# Altium project SOUL_EEG.PrjPcb
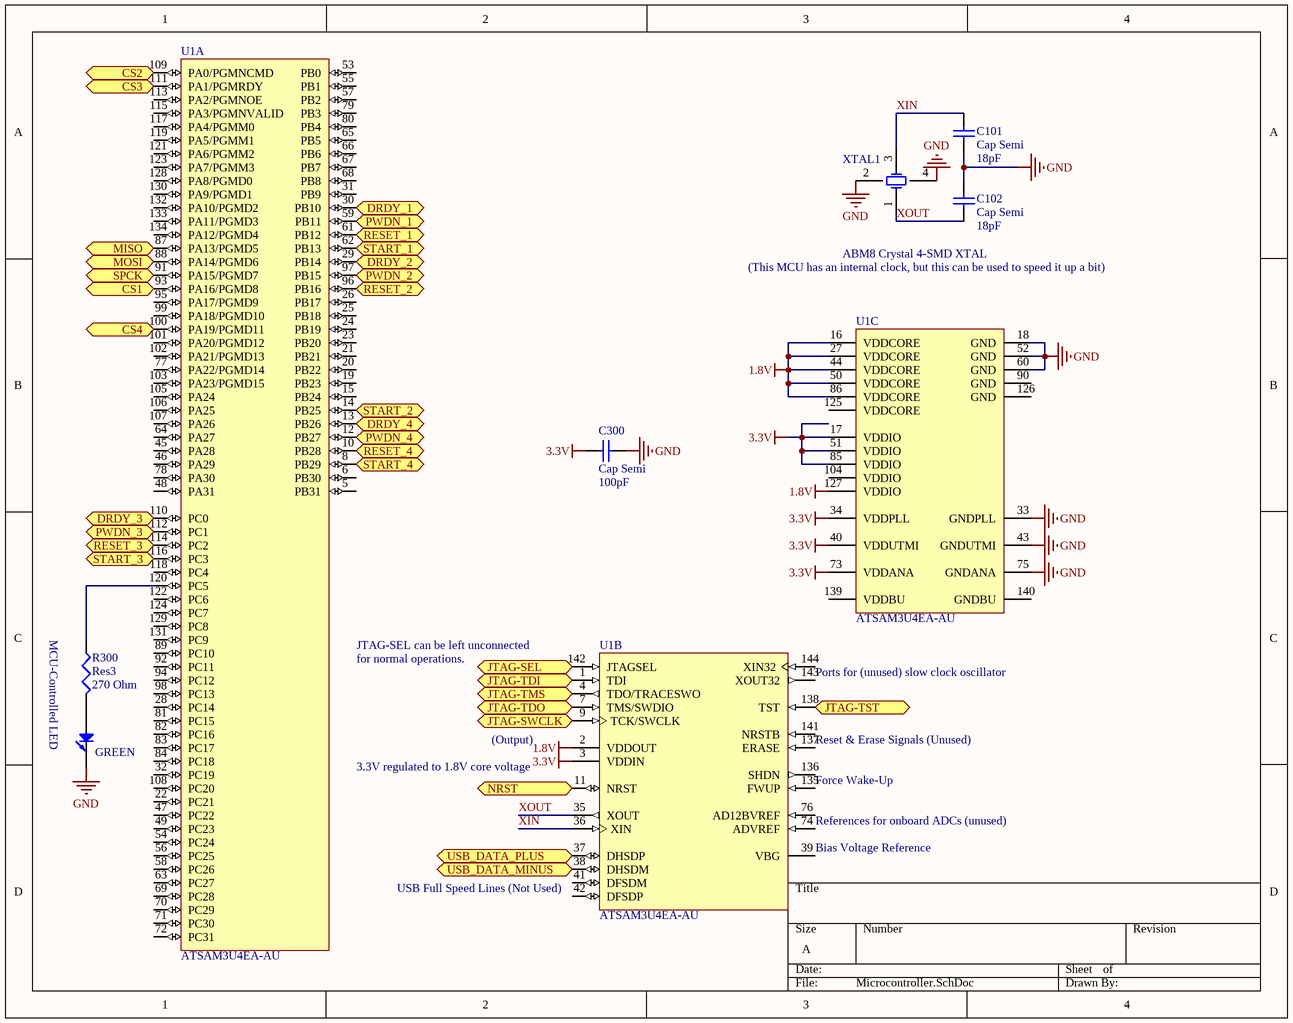
[diagram p0: Microcontroller.SchDoc]
7 sheets, 183 parts. Net scope: flat (ports and power ports of the same name join across sheets).
Board file: SOUL_EEG_PCB_Rev1.PcbDoc
Sheets:
  Microcontroller.SchDoc
  JTAG_Connector.SchDoc
  USB_Controller.SchDoc
  EEG_1.SchDoc
  EEG_2.SchDoc
  EEG_3.SchDoc
  EEG_4.SchDoc

## Sheet Microcontroller.SchDoc
size A

### Parts
C101  Cap Semi  value 18pF  [1608[0603]]
C102  Cap Semi  value 18pF  [1608[0603]]
C300  Cap Semi  value 100pF  [C1206]
LED2  GREEN  [1608[0603]]
R300  Res3  value 270 Ohm  [1608[0603]]
U1  ATSAM3U4EA-AU  [144L1_N]  (parts A,B,C of 3)
XTAL1  ABM8 Crystal 4-SMD XTAL  [ABM8 Crystal XTAL]

### Ports
CS1, CS2, CS3, CS4, DRDY_1, DRDY_2, DRDY_3, DRDY_4, JTAG-SEL, JTAG-SWCLK, JTAG-TDI, JTAG-TDO, JTAG-TMS, JTAG-TST, MISO, MOSI, NRST, PWDN_1, PWDN_2, PWDN_3, PWDN_4, RESET_1, RESET_2, RESET_3, RESET_4, SPCK, START_1, START_2, START_3, START_4, USB_DATA_MINUS, USB_DATA_PLUS

### Nets
1.8V: U1.2(VDDOUT) U1.16(VDDCORE) U1.27(VDDCORE) U1.44(VDDCORE) U1.50(VDDCORE) U1.86(VDDCORE) U1.127(VDDIO)
3.3V: C300.1 U1.3(VDDIN) U1.17(VDDIO) U1.34(VDDPLL) U1.40(VDDUTMI) U1.51(VDDIO) U1.73(VDDANA) U1.85(VDDIO)
GND: C101.1 C102.2 C300.2 LED2.2(K) U1.18(GND) U1.33(GNDPLL) U1.43(GNDUTMI) U1.52(GND) U1.60(GND) U1.75(GNDANA) XTAL1.2(GND) XTAL1.4(GND)
XIN: C101.2 U1.36(XIN) XTAL1.3(OSC2)
XOUT: C102.1 U1.35(XOUT) XTAL1.1(OSC1)
NetLED2_1: LED2.1(A) R300.2
NetP100_5: U1.1(TDI) ; port JTAG-TDI
NetP100_7: U1.4(TDO/TRACESWO) ; port JTAG-TMS
NetP100_9: U1.9(TCK/SWCLK) ; port JTAG-SWCLK
NetP100_13: U1.7(TMS/SWDIO) ; port JTAG-TDO
NetP100_15: U1.11(NRST) ; port NRST
NetP101_1: U1.138(TST) ; port JTAG-TST
NetP102_2: U1.38(DHSDM) ; port USB_DATA_MINUS
NetP102_3: U1.37(DHSDP) ; port USB_DATA_PLUS
NetR300_1: R300.1 U1.120(PC5)
NetU1_8: U1.8(PB29) ; port START_4
NetU1_10: U1.10(PB28) ; port RESET_4
NetU1_12: U1.12(PB27) ; port PWDN_4
NetU1_13: U1.13(PB26) ; port DRDY_4
NetU1_14: U1.14(PB25) ; port START_2
NetU1_29: U1.29(PB14) ; port DRDY_2
NetU1_30: U1.30(PB10) ; port DRDY_1
NetU1_59: U1.59(PB11) ; port PWDN_1
NetU1_61: U1.61(PB12) ; port RESET_1
NetU1_62: U1.62(PB13) ; port START_1
NetU1_87: U1.87(PA13/PGMD5) ; port MISO
NetU1_88: U1.88(PA14/PGMD6) ; port MOSI
NetU1_91: U1.91(PA15/PGMD7) ; port SPCK
NetU1_93: U1.93(PA16/PGMD8) ; port CS1
NetU1_96: U1.96(PB16) ; port RESET_2
NetU1_97: U1.97(PB15) ; port PWDN_2
NetU1_100: U1.100(PA19/PGMD11) ; port CS4
NetU1_109: U1.109(PA0/PGMNCMD) ; port CS2
NetU1_110: U1.110(PC0) ; port DRDY_3
NetU1_111: U1.111(PA1/PGMRDY) ; port CS3
NetU1_112: U1.112(PC1) ; port PWDN_3
NetU1_114: U1.114(PC2) ; port RESET_3
NetU1_116: U1.116(PC3) ; port START_3
NetU1_142: U1.142(JTAGSEL) ; port JTAG-SEL

Not connected (* = marked no-connect by the designer): U1 5(PB31) 6(PB30) 15(PB24) 19(PB23) 20(PB22) 21(PB21) 22(PC21) 23(PB20) 24(PB19) 25(PB18) 26(PB17) 28(PC14) 31(PB9) 32(PC19) 39(VBG) 41(DFSDM) 42(DFSDP) 45(PA28) 46(PA29) 47(PC22) 48(PA31) 49(PC23) 53(PB0) 54(PC24) 55(PB1) 56(PC25) 57(PB2) 58(PC26) 63(PC27) 64(PA27) 65(PB5) 66(PB6) 67(PB7) 68(PB8) 69(PC28) 70(PC29) 71(PC30) 72(PC31) 74(ADVREF) 76(AD12BVREF) 77(PA22/PGMD14) 78(PA30) 79(PB3) 80(PB4) 81(PC15) 82(PC16) 83(PC17) 84(PC18) 89(PC10) 90(GND) 92(PC11) 94(PC12) 95(PA17/PGMD9) 98(PC13) 99(PA18/PGMD10) 101(PA20/PGMD12) 102(PA21/PGMD13) 103(PA23/PGMD15) 104(VDDIO) 105(PA24) 106(PA25) 107(PA26) 108(PC20) 113(PA2/PGMNOE) 115(PA3/PGMNVALID) 117(PA4/PGMM0) 118(PC4) 119(PA5/PGMM1) 121(PA6/PGMM2) 122(PC6) 123(PA7/PGMM3) 124(PC7) 125(VDDCORE) 126(GND) 128(PA8/PGMD0) 129(PC8) 130(PA9/PGMD1) 131(PC9) 132(PA10/PGMD2) 133(PA11/PGMD3) 134(PA12/PGMD4) 135(FWUP) 136(SHDN) 137(ERASE) 139(VDDBU) 140(GNDBU) 141(NRSTB) 143(XOUT32) 144(XIN32)

### Notes on the sheet
- (This MCU has an internal clock, but this can be used to speed it up a bit)
- MCU-Controlled LED
- (near U1) JTAG-SEL can be left unconnected
- (near U1) for normal operations.
- (near U1) Ports for (unused) slow clock oscillator
- (near U1) 3.3V regulated to 1.8V core voltage
- (Output)
- (near U1) Reset & Erase Signals (Unused)
- (near U1) Force Wake-Up
- (near U1) References for onboard ADCs (unused)
- (near U1) USB Full Speed Lines (Not Used)
- (near U1) Bias Voltage Reference

### Library data of the parts
C101 C102 C300 = Cap Semi: Capacitor (Semiconductor SIM Model); Published: 8-Jun-2000; LatestRevisionDate: 29-May-2009; LatestRevisionNote: IPC-7351 Footprint Added.; PackageReference: C1206; Publisher: Altium Limited; PackageDescription: Chip Capacitor
LED2 = LED0: led; Manufacturer: Lite-On Inc; Manufacturer Part Number: LTST-C193KGKT-5A; Wavelength - Dominant: 572nm; Wavelength - Peak: 574nm; Millicandela Rating: 16.25mcd; Voltage - Forward (Vf) (Typ): 2V; Current - Test: 5mA; Viewing Angle: 130°; Lens Type: Clear; Lens Style/Size: Rectangle with Flat Top, 1.15mm x 0.8mm; Supplier 1: Digi-Key; Supplier Part Number 1: 160-1828-1-ND; RoHS: RoHS Compliant; Category: Optoelectronics; Stock 1: 69140; Pricing 1: 1=0.43, 10=0.315, 100=0.167, 250=0.11812, 500=0.1008, 1000=0.07875 (USD); Packaging: Cut Tape (CT); Color: Green; Package / Case: 0603 (1608 Metric); Size / Dimension: 1.60mm L x 0.80mm W; Height: 0.35mm; Mounting Type: Surface Mount; Luminous Flux @ Current - Test: -; ComponentLink1URL: http://optoelectronics.liteon.com/upload/download/DS22-2007-0094/S_110_LTST-C193KGKT-5A.pdf; ComponentLink1Description: http://optoelectronics.liteon.com/upload/download/DS22-2007-0094/S_110_LTST-C193KGKT-5A.pdf
R300 = Res3: Resistor; Published: 8-Jun-2000; LatestRevisionDate: 29-May-2009; LatestRevisionNote: IPC-7351 Footprint Added.; PackageReference: J1-0603; Publisher: Altium Limited; PackageDescription: Chip Resistor
U1 = ATSAM3U4EA-AU: AT91 ARM Cortex-M3 32-bit Microcontroller, 2x128KB Flash, 52KB SRAM, 96 User I/Os, 4USARTs, 144-Pin LQFP, Industrial Grade (-40°C to 85°C), Pb-Free; Published: 20-Sep-2010; DatasheetVersion: revC, Apr-2010; PackageVersion: rev.A, Nov-2001; PackageReference: 144L1; Publisher: Altium Limited; PackageDescription: 144-Pin Thin Quad Flat Pack 0.5 mm Pitch; Supplier 1: Digi-Key; Supplier Part Number 1: ATSAM3U4EA-AU-ND; Supplier 2: Mouser; Supplier Part Number 2: 556-ATSAM3U4EA-AU; Code_JEDEC: MS-026-BFB; ComponentLink1Description: Manufacturer Link; ComponentLink1URL: http://www.atmel.com/products/AT91/default.asp?; ComponentLink2Description: SAM3U Series Datasheet; ComponentLink2URL: http://www.atmel.com/dyn/resources/prod_documents/doc6430.pdf; ComponentLink3Description: SAM3U Series Summary; ComponentLink3URL: http://www.atmel.com/dyn/resources/prod_documents/6430s.pdf; ComponentLink4Description: Atmel.com Home; ComponentLink4URL: http://www.atmel.com
XTAL1 = ABM8 Crystal 4-SMD XTAL_1: SMD Crystal

## Sheet JTAG_Connector.SchDoc
size A
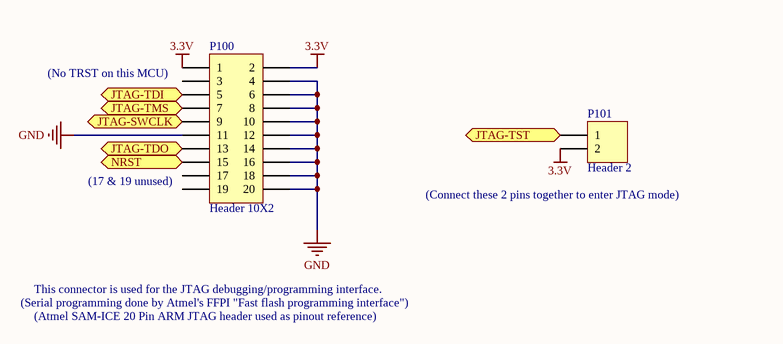
[diagram p1: JTAG_Connector.SchDoc]

### Parts
P100  Header 10X2  [HDR2X10]
P101  Header 2  [HDR1X2]

### Ports
JTAG-SWCLK, JTAG-TDI, JTAG-TDO, JTAG-TMS, JTAG-TST, NRST

### Nets
3.3V: P100.1 P100.2 P101.2
GND: P100.4 P100.6 P100.8 P100.10 P100.11 P100.12 P100.14 P100.16 P100.18 P100.20
NetP100_5: P100.5 ; port JTAG-TDI
NetP100_7: P100.7 ; port JTAG-TMS
NetP100_9: P100.9 ; port JTAG-SWCLK
NetP100_13: P100.13 ; port JTAG-TDO
NetP100_15: P100.15 ; port NRST
NetP101_1: P101.1 ; port JTAG-TST

Not connected (* = marked no-connect by the designer): P100 3 17 19

### Notes on the sheet
- (near P100) (No TRST on this MCU)
- (near P100) (17 & 19 unused)
- (near P101) (Connect these 2 pins together to enter JTAG mode)
- (Serial programming done by Atmel's FFPI "Fast flash programming interface")
- This connector is used for the JTAG debugging/programming interface.
- (Atmel SAM-ICE 20 Pin ARM JTAG header used as pinout reference)

### Library data of the parts
P100 = Header 10X2: Header, 10-Pin, Dual row; LatestRevisionDate: 17-Jul-2002; LatestRevisionNote: Re-released for DXP Platform.; Publisher: Altium Limited
P101 = Header 2: Header, 2-Pin; LatestRevisionDate: 17-Jul-2002; LatestRevisionNote: Re-released for DXP Platform.; Publisher: Altium Limited

## Sheet USB_Controller.SchDoc
size A
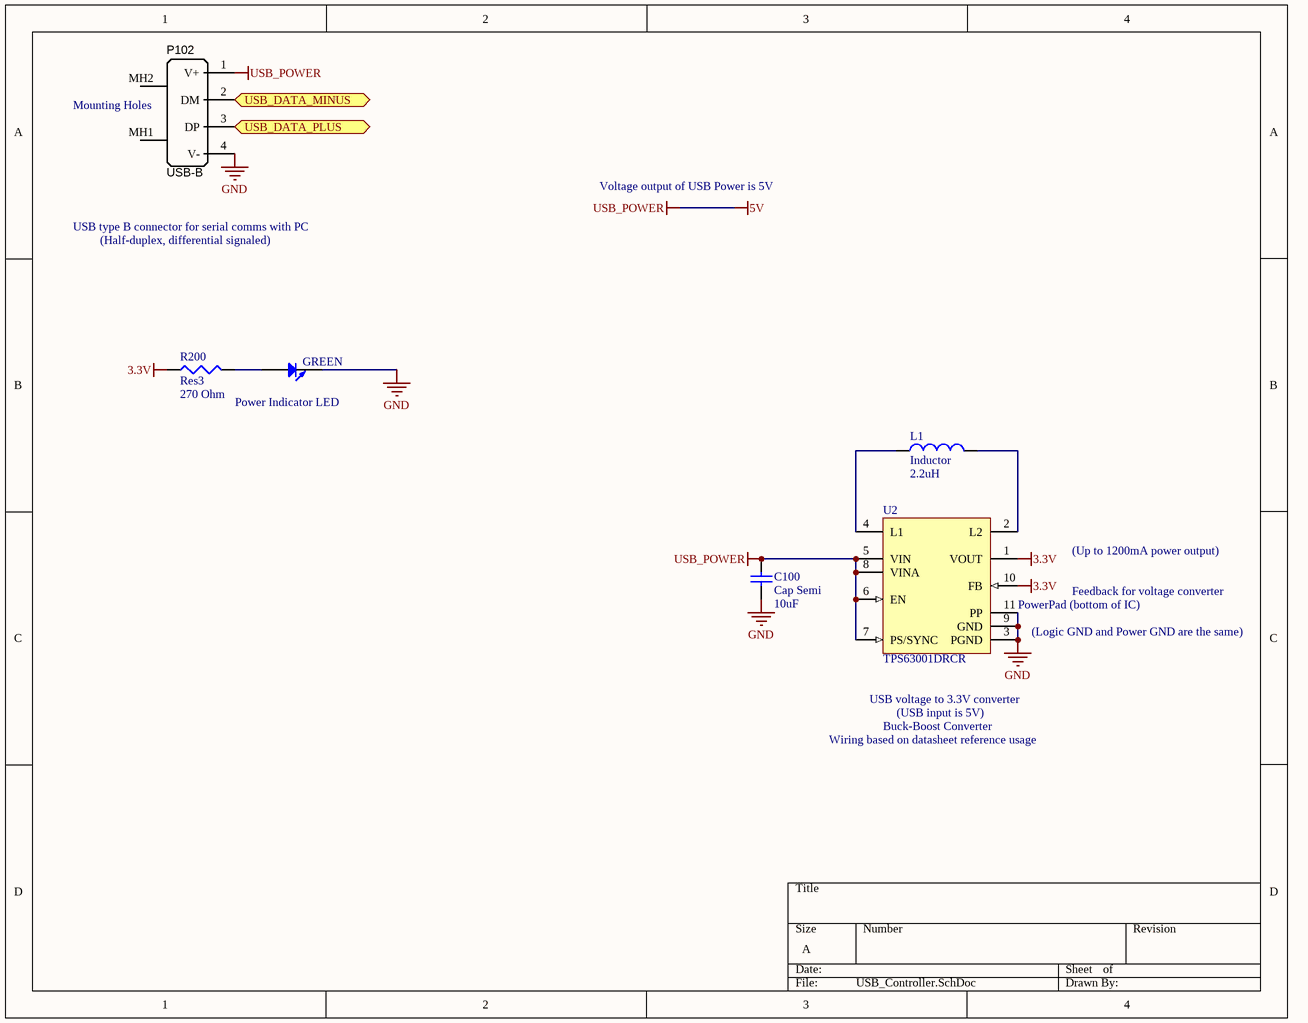
[diagram p2: USB_Controller.SchDoc]

### Parts
C100  Cap Semi  value 10uF  [1608[0603]]
L1  Inductor  value 2.2uH  [INDC3216]
LED1  GREEN  [1608[0603]]
P102  USB-B  [USB_TypeB_Tyco]
R200  Res3  value 270 Ohm  [1608[0603]]
U2  TPS63001DRCR  [DRC10-2400X1650TP]

### Ports
USB_DATA_MINUS, USB_DATA_PLUS

### Nets
3.3V: R200.1 U2.1(VOUT) U2.10(FB)
5V: C100.2 P102.1(V+) U2.5(VIN) U2.6(EN) U2.7(PS/SYNC) U2.8(VINA)  [also labelled USB_POWER]
GND: C100.1 LED1.2(K) P102.4(V-) U2.3(PGND) U2.9(GND) U2.11(PP)
NetL1_1: L1.1 U2.4(L1)
NetL1_2: L1.2 U2.2(L2)
NetLED1_1: LED1.1(A) R200.2
NetP102_2: P102.2(DM) ; port USB_DATA_MINUS
NetP102_3: P102.3(DP) ; port USB_DATA_PLUS

Not connected (* = marked no-connect by the designer): P102 MH1(Shell) MH2(Shell)

### Notes on the sheet
- (near P102) Mounting Holes
- USB type B connector for serial comms with PC
- Voltage output of USB Power is 5V
- (Half-duplex, differential signaled)
- Power Indicator LED
- (Up to 1200mA power output)
- (near U2) PowerPad (bottom of IC)
- (near U2) (Logic GND and Power GND are the same)
- Feedback for voltage converter
- USB voltage to 3.3V converter
- Wiring based on datasheet reference usage
- Buck-Boost Converter
- (USB input is 5V)

### Library data of the parts
C100 = Cap Semi: Capacitor (Semiconductor SIM Model); Published: 8-Jun-2000; LatestRevisionDate: 29-May-2009; LatestRevisionNote: IPC-7351 Footprint Added.; PackageReference: C1206; Publisher: Altium Limited; PackageDescription: Chip Capacitor
L1 = Inductor: Code_IEC: 1005; Published: 8-Jun-2000; LatestRevisionDate: 29-May-2009; LatestRevisionNote: IPC-7351 Footprint Added.; PackageReference: 0402-A; Publisher: Altium Limited; PackageDescription: Chip Inductor; Code_JEITA: 0402
LED1 = LED0: as LED2 on sheet Microcontroller; Supplier 1: Digi-Key; Supplier Part Number 1: 160-1828-1-ND; RoHS: RoHS Compliant; Category: Optoelectronics; Stock 1: 69140; Pricing 1: 1=0.43, 10=0.315, 100=0.167, 250=0.11812, 500=0.1008, 1000=0.07875 (USD); Packaging: Cut Tape (CT); Color: Green; Package / Case: 0603 (1608 Metric); Size / Dimension: 1.60mm L x 0.80mm W; Height: 0.35mm; Mounting Type: Surface Mount; Luminous Flux @ Current - Test: -; ComponentLink1URL: http://optoelectronics.liteon.com/upload/download/DS22-2007-0094/S_110_LTST-C193KGKT-5A.pdf; ComponentLink1Description: http://optoelectronics.liteon.com/upload/download/DS22-2007-0094/S_110_LTST-C193KGKT-5A.pdf
P102 = USB_TypeB: Connector THT Type B USB connector; Manufacturer Part Number 1: 292304-1; Manufacturer 1: TE Connectivity; Specifications: USB 2.0; SCDType: undef; Package / Case: R/A Type B; Supplier 1: Digi-Key; Connector Type: USB - B; Supplier Part Number 1: A31725-ND
R200 = Res3: Resistor; Published: 8-Jun-2000; LatestRevisionDate: 29-May-2009; LatestRevisionNote: IPC-7351 Footprint Added.; PackageReference: J1-0603; Publisher: Altium Limited; PackageDescription: Chip Resistor
U2 = TPS63001DRCR: Buck-Boost Voltage Converter with 1.8 to 5.5 V Input and 3.3 V Output, -40 to 85 degC, 10-Pin SON (DRC), Green (RoHS & no Sb/Br); Manufacturer: Texas Instruments; Dynamic Voltage Scaling: TRUE; Iout(Max)(A): 1.2; Iq(Typ)(mA): 0.03; Preset Vout(V): 3.3; Regulated Outputs(#): 1; SubFamily: Buck-Boost Regulator; Switching Frequency(Max)(kHz): 1500; Vin(Max)(V): 5.5; Vin(Min)(V): 1.8; DatasheetVersion: SLVS520B; PackageVersion: revL, Sep-2011; PackageReference: DRC10-2400X1650TP; PackageDescription: 10-Pin Plastic Small Outline No-Lead, 3 x 3 x 1 mm Body, 0.5 mm Pitch, Exposed Pad; Supplier 1: Digi-Key; Supplier Part Number 1: 296-19643-2-ND; Supplier 2: Digi-Key; Supplier Part Number 2: 296-19643-1-ND; Supplier 3: Digi-Key; Supplier Part Number 3: 296-19643-6-ND; Supplier 4: Farnell; Supplier Part Number 4: 1412595; Supplier 5: Newark; Supplier Part Number 5: 85K1711; Supplier 6: Mouser; Supplier Part Number 6: 595-TPS63001DRCR; Eco-Plan: Green (RoHS & no Sb/Br); Synchronous Rectification: TRUE; Topology: Buck-Boost; Vout(Max)(V): 3.3; Vout(Min)(V): 3.3; Mounting Technology: Surface Mount; PartNumber: TPS63001DRCR; ComponentLink1Description: Datasheet; ComponentLink1URL: http://www.ti.com/general/docs/lit/getliterature.tsp?genericPartNumber=TPS63001&fileType=pdf; ComponentLink2Description: Package Specification; ComponentLink2URL: http://www.ti.com/litv/pdf/mpds117k

## Sheet EEG_1.SchDoc
size A3
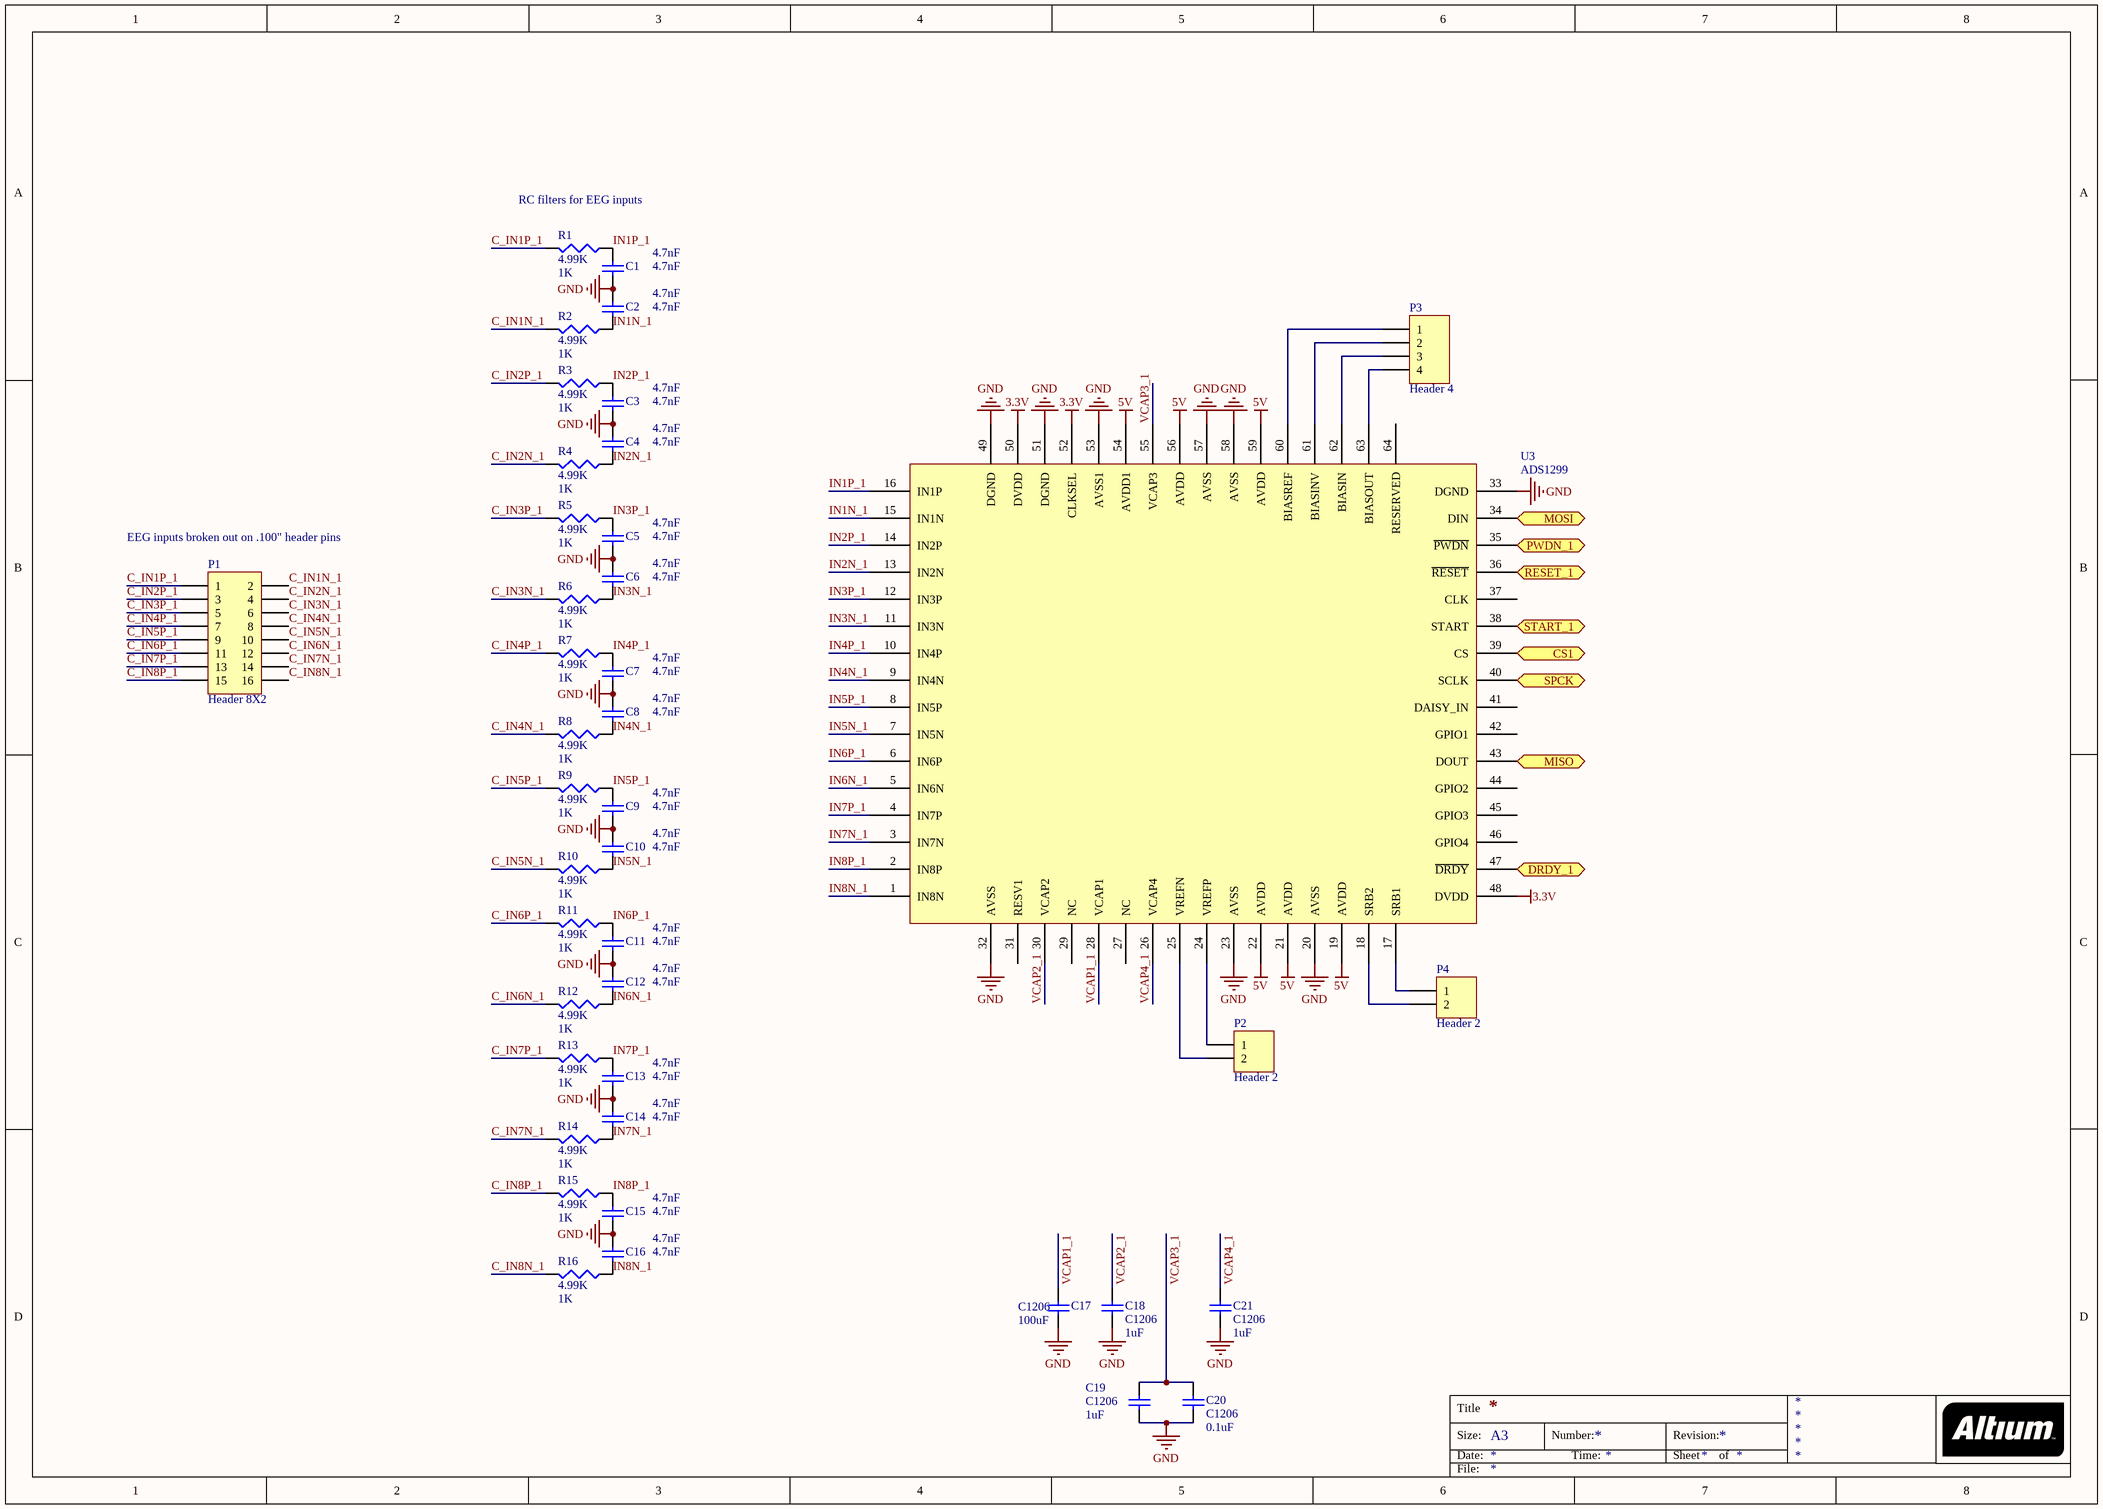
[diagram p3: EEG_1.SchDoc]

### Parts
C1  4.7nF  [1608[0603]]
C2  4.7nF  [1608[0603]]
C3  4.7nF  [1608[0603]]
C4  4.7nF  [1608[0603]]
C5  4.7nF  [1608[0603]]
C6  4.7nF  [1608[0603]]
C7  4.7nF  [1608[0603]]
C8  4.7nF  [1608[0603]]
C9  4.7nF  [1608[0603]]
C10  4.7nF  [1608[0603]]
C11  4.7nF  [1608[0603]]
C12  4.7nF  [1608[0603]]
C13  4.7nF  [1608[0603]]
C14  4.7nF  [1608[0603]]
C15  4.7nF  [1608[0603]]
C16  4.7nF  [1608[0603]]
C17  C1206  value 100uF  [1608[0603]]
C18  C1206  value 1uF  [1608[0603]]
C19  C1206  value 1uF  [1608[0603]]
C20  C1206  value 0.1uF  [1608[0603]]
C21  C1206  value 1uF  [1608[0603]]
P1  Header 8X2  [HDR2X8]
P2  Header 2  [HDR1X2]
P3  Header 4  [HDR1X4]
P4  Header 2  [HDR1X2]
R1  4.99K  value 1K  [1608[0603]]
R2  4.99K  value 1K  [1608[0603]]
R3  4.99K  value 1K  [1608[0603]]
R4  4.99K  value 1K  [1608[0603]]
R5  4.99K  value 1K  [1608[0603]]
R6  4.99K  value 1K  [1608[0603]]
R7  4.99K  value 1K  [1608[0603]]
R8  4.99K  value 1K  [1608[0603]]
R9  4.99K  value 1K  [1608[0603]]
R10  4.99K  value 1K  [1608[0603]]
R11  4.99K  value 1K  [1608[0603]]
R12  4.99K  value 1K  [1608[0603]]
R13  4.99K  value 1K  [1608[0603]]
R14  4.99K  value 1K  [1608[0603]]
R15  4.99K  value 1K  [1608[0603]]
R16  4.99K  value 1K  [1608[0603]]
U3  ADS1299  [ADS1299 Plastic QFP]

### Ports
CS1, DRDY_1, MISO, MOSI, PWDN_1, RESET_1, SPCK, START_1

### Nets
3.3V: U3.48(DVDD) U3.50(DVDD) U3.52(CLKSEL)
5V: U3.19(AVDD) U3.21(AVDD) U3.22(AVDD) U3.54(AVDD1) U3.56(AVDD) U3.59(AVDD)
GND: C1.1 C2.2 C3.1 C4.2 C5.1 C6.2 C7.1 C8.2 C9.1 C10.2 C11.1 C12.2 C13.1 C14.2 C15.1 C16.2 C17.2 C18.1 C19.2 C20.1 C21.1 U3.20(AVSS) U3.23(AVSS) U3.32(AVSS) U3.33(DGND) U3.49(DGND) U3.51(DGND) U3.53(AVSS1) U3.57(AVSS) U3.58(AVSS)
C_IN1N_1: P1.2 R2.2
C_IN1P_1: P1.1 R1.2
C_IN2N_1: P1.4 R4.2
C_IN2P_1: P1.3 R3.2
C_IN3N_1: P1.6 R6.2
C_IN3P_1: P1.5 R5.2
C_IN4N_1: P1.8 R8.2
C_IN4P_1: P1.7 R7.2
C_IN5N_1: P1.10 R10.2
C_IN5P_1: P1.9 R9.2
C_IN6N_1: P1.12 R12.2
C_IN6P_1: P1.11 R11.2
C_IN7N_1: P1.14 R14.2
C_IN7P_1: P1.13 R13.2
C_IN8N_1: P1.16 R16.2
C_IN8P_1: P1.15 R15.2
IN1N_1: C2.1 R2.1 U3.15(IN1N)
IN1P_1: C1.2 R1.1 U3.16(IN1P)
IN2N_1: C4.1 R4.1 U3.13(IN2N)
IN2P_1: C3.2 R3.1 U3.14(IN2P)
IN3N_1: C6.1 R6.1 U3.11(IN3N)
IN3P_1: C5.2 R5.1 U3.12(IN3P)
IN4N_1: C8.1 R8.1 U3.9(IN4N)
IN4P_1: C7.2 R7.1 U3.10(IN4P)
IN5N_1: C10.1 R10.1 U3.7(IN5N)
IN5P_1: C9.2 R9.1 U3.8(IN5P)
IN6N_1: C12.1 R12.1 U3.5(IN6N)
IN6P_1: C11.2 R11.1 U3.6(IN6P)
IN7N_1: C14.1 R14.1 U3.3(IN7N)
IN7P_1: C13.2 R13.1 U3.4(IN7P)
IN8N_1: C16.1 R16.1 U3.1(IN8N)
IN8P_1: C15.2 R15.1 U3.2(IN8P)
VCAP1_1: C17.1 U3.28(VCAP1)
VCAP2_1: C18.2 U3.30(VCAP2)
VCAP3_1: C19.1 C20.2 U3.55(VCAP3)
VCAP4_1: C21.2 U3.26(VCAP4)
NetP2_1: P2.1 U3.24(VREFP)
NetP2_2: P2.2 U3.25(VREFN)
NetP3_1: P3.1 U3.60(BIASREF)
NetP3_2: P3.2 U3.61(BIASINV)
NetP3_3: P3.3 U3.62(BIASIN)
NetP3_4: P3.4 U3.63(BIASOUT)
NetP4_1: P4.1 U3.17(SRB1)
NetP4_2: P4.2 U3.18(SRB2)
NetU1_30: U3.47(~{DRDY}) ; port DRDY_1
NetU1_59: U3.35(~{PWDN}) ; port PWDN_1
NetU1_61: U3.36(~{RESET}) ; port RESET_1
NetU1_62: U3.38(START) ; port START_1
NetU1_87: U3.43(DOUT) ; port MISO
NetU1_88: U3.34(DIN) ; port MOSI
NetU1_91: U3.40(SCLK) ; port SPCK
NetU1_93: U3.39(CS) ; port CS1

Not connected (* = marked no-connect by the designer): U3 27(NC) 29(NC) 31(RESV1) 37(CLK) 41(DAISY_IN) 42(GPIO1) 44(GPIO2) 45(GPIO3) 46(GPIO4) 64(RESERVED)

### Notes on the sheet
- RC filters for EEG inputs
- (near P1) EEG inputs broken out on .100" header pins
- Title
- Size:
- Date:
- A3
- Number:
- Time:
- Revision:
- Sheet
- of
- File:

### Library data of the parts
C1-C21 = Cap Semi: Capacitor (Semiconductor SIM Model); Published: 8-Jun-2000; LatestRevisionDate: 29-May-2009; LatestRevisionNote: IPC-7351 Footprint Added.; PackageReference: C1206; Publisher: Altium Limited; PackageDescription: Chip Capacitor
  C1-C16: Value: 4.7nF
P1 = Header 8X2: Header, 8-Pin, Dual row; LatestRevisionDate: 17-Jul-2002; LatestRevisionNote: Re-released for DXP Platform.; Publisher: Altium Limited
P2 P4 = Header 2: Header, 2-Pin; LatestRevisionDate: 17-Jul-2002; LatestRevisionNote: Re-released for DXP Platform.; Publisher: Altium Limited
P3 = Header 4: Header, 4-Pin; LatestRevisionDate: 17-Jul-2002; LatestRevisionNote: Re-released for DXP Platform.; Publisher: Altium Limited
R1-R16 = Res3: Resistor; Published: 8-Jun-2000; LatestRevisionDate: 29-May-2009; LatestRevisionNote: IPC-7351 Footprint Added.; PackageReference: J1-0603; Publisher: Altium Limited; PackageDescription: Chip Resistor

## Sheet EEG_2.SchDoc
size A3
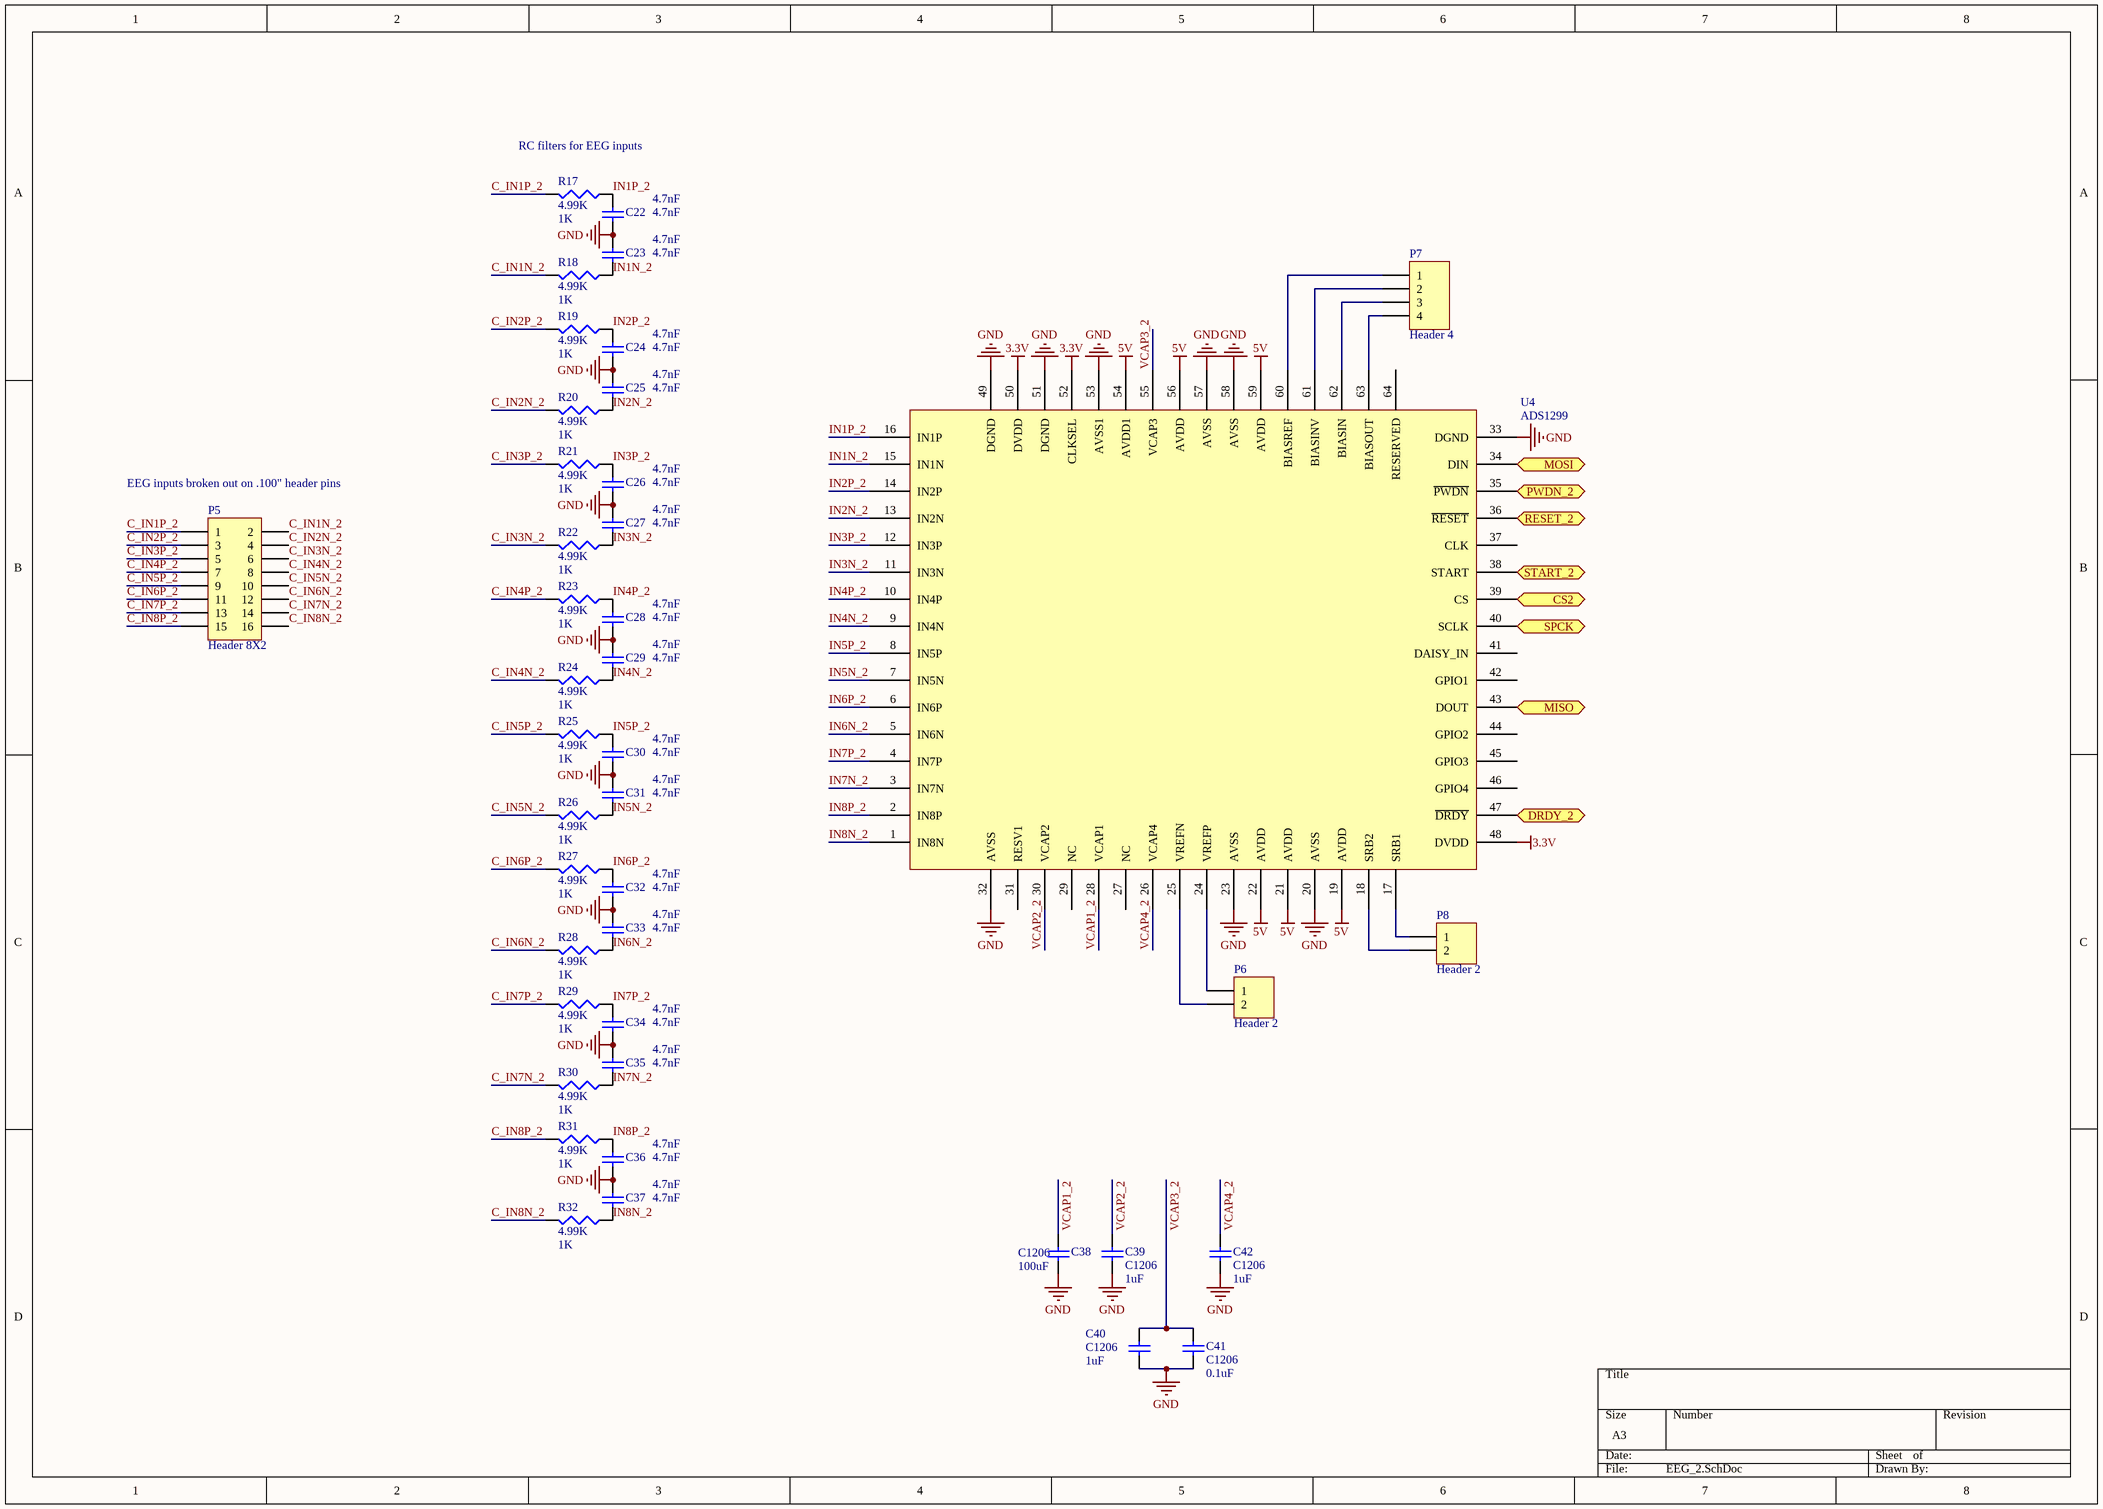
[diagram p4: EEG_2.SchDoc]

### Parts
C22  4.7nF  [1608[0603]]
C23  4.7nF  [1608[0603]]
C24  4.7nF  [1608[0603]]
C25  4.7nF  [1608[0603]]
C26  4.7nF  [1608[0603]]
C27  4.7nF  [1608[0603]]
C28  4.7nF  [1608[0603]]
C29  4.7nF  [1608[0603]]
C30  4.7nF  [1608[0603]]
C31  4.7nF  [1608[0603]]
C32  4.7nF  [1608[0603]]
C33  4.7nF  [1608[0603]]
C34  4.7nF  [1608[0603]]
C35  4.7nF  [1608[0603]]
C36  4.7nF  [1608[0603]]
C37  4.7nF  [1608[0603]]
C38  C1206  value 100uF  [1608[0603]]
C39  C1206  value 1uF  [1608[0603]]
C40  C1206  value 1uF  [1608[0603]]
C41  C1206  value 0.1uF  [1608[0603]]
C42  C1206  value 1uF  [1608[0603]]
P5  Header 8X2  [HDR2X8]
P6  Header 2  [HDR1X2]
P7  Header 4  [HDR1X4]
P8  Header 2  [HDR1X2]
R17  4.99K  value 1K  [1608[0603]]
R18  4.99K  value 1K  [1608[0603]]
R19  4.99K  value 1K  [1608[0603]]
R20  4.99K  value 1K  [1608[0603]]
R21  4.99K  value 1K  [1608[0603]]
R22  4.99K  value 1K  [1608[0603]]
R23  4.99K  value 1K  [1608[0603]]
R24  4.99K  value 1K  [1608[0603]]
R25  4.99K  value 1K  [1608[0603]]
R26  4.99K  value 1K  [1608[0603]]
R27  4.99K  value 1K  [1608[0603]]
R28  4.99K  value 1K  [1608[0603]]
R29  4.99K  value 1K  [1608[0603]]
R30  4.99K  value 1K  [1608[0603]]
R31  4.99K  value 1K  [1608[0603]]
R32  4.99K  value 1K  [1608[0603]]
U4  ADS1299  [ADS1299 Plastic QFP]

### Ports
CS2, DRDY_2, MISO, MOSI, PWDN_2, RESET_2, SPCK, START_2

### Nets
3.3V: U4.48(DVDD) U4.50(DVDD) U4.52(CLKSEL)
5V: U4.19(AVDD) U4.21(AVDD) U4.22(AVDD) U4.54(AVDD1) U4.56(AVDD) U4.59(AVDD)
GND: C22.1 C23.2 C24.1 C25.2 C26.1 C27.2 C28.1 C29.2 C30.1 C31.2 C32.1 C33.2 C34.1 C35.2 C36.1 C37.2 C38.2 C39.1 C40.2 C41.1 C42.1 U4.20(AVSS) U4.23(AVSS) U4.32(AVSS) U4.33(DGND) U4.49(DGND) U4.51(DGND) U4.53(AVSS1) U4.57(AVSS) U4.58(AVSS)
C_IN1N_2: P5.2 R18.2
C_IN1P_2: P5.1 R17.2
C_IN2N_2: P5.4 R20.2
C_IN2P_2: P5.3 R19.2
C_IN3N_2: P5.6 R22.2
C_IN3P_2: P5.5 R21.2
C_IN4N_2: P5.8 R24.2
C_IN4P_2: P5.7 R23.2
C_IN5N_2: P5.10 R26.2
C_IN5P_2: P5.9 R25.2
C_IN6N_2: P5.12 R28.2
C_IN6P_2: P5.11 R27.2
C_IN7N_2: P5.14 R30.2
C_IN7P_2: P5.13 R29.2
C_IN8N_2: P5.16 R32.2
C_IN8P_2: P5.15 R31.2
IN1N_2: C23.1 R18.1 U4.15(IN1N)
IN1P_2: C22.2 R17.1 U4.16(IN1P)
IN2N_2: C25.1 R20.1 U4.13(IN2N)
IN2P_2: C24.2 R19.1 U4.14(IN2P)
IN3N_2: C27.1 R22.1 U4.11(IN3N)
IN3P_2: C26.2 R21.1 U4.12(IN3P)
IN4N_2: C29.1 R24.1 U4.9(IN4N)
IN4P_2: C28.2 R23.1 U4.10(IN4P)
IN5N_2: C31.1 R26.1 U4.7(IN5N)
IN5P_2: C30.2 R25.1 U4.8(IN5P)
IN6N_2: C33.1 R28.1 U4.5(IN6N)
IN6P_2: C32.2 R27.1 U4.6(IN6P)
IN7N_2: C35.1 R30.1 U4.3(IN7N)
IN7P_2: C34.2 R29.1 U4.4(IN7P)
IN8N_2: C37.1 R32.1 U4.1(IN8N)
IN8P_2: C36.2 R31.1 U4.2(IN8P)
VCAP1_2: C38.1 U4.28(VCAP1)
VCAP2_2: C39.2 U4.30(VCAP2)
VCAP3_2: C40.1 C41.2 U4.55(VCAP3)
VCAP4_2: C42.2 U4.26(VCAP4)
NetP6_1: P6.1 U4.24(VREFP)
NetP6_2: P6.2 U4.25(VREFN)
NetP7_1: P7.1 U4.60(BIASREF)
NetP7_2: P7.2 U4.61(BIASINV)
NetP7_3: P7.3 U4.62(BIASIN)
NetP7_4: P7.4 U4.63(BIASOUT)
NetP8_1: P8.1 U4.17(SRB1)
NetP8_2: P8.2 U4.18(SRB2)
NetU1_14: U4.38(START) ; port START_2
NetU1_29: U4.47(~{DRDY}) ; port DRDY_2
NetU1_87: U4.43(DOUT) ; port MISO
NetU1_88: U4.34(DIN) ; port MOSI
NetU1_91: U4.40(SCLK) ; port SPCK
NetU1_96: U4.36(~{RESET}) ; port RESET_2
NetU1_97: U4.35(~{PWDN}) ; port PWDN_2
NetU1_109: U4.39(CS) ; port CS2

Not connected (* = marked no-connect by the designer): U4 27(NC) 29(NC) 31(RESV1) 37(CLK) 41(DAISY_IN) 42(GPIO1) 44(GPIO2) 45(GPIO3) 46(GPIO4) 64(RESERVED)

### Notes on the sheet
- RC filters for EEG inputs
- (near P5) EEG inputs broken out on .100" header pins

### Library data of the parts
C22-C42 = Cap Semi: Capacitor (Semiconductor SIM Model); Published: 8-Jun-2000; LatestRevisionDate: 29-May-2009; LatestRevisionNote: IPC-7351 Footprint Added.; PackageReference: C1206; Publisher: Altium Limited; PackageDescription: Chip Capacitor
  C22-C37: Value: 4.7nF
P5 = Header 8X2: Header, 8-Pin, Dual row; LatestRevisionDate: 17-Jul-2002; LatestRevisionNote: Re-released for DXP Platform.; Publisher: Altium Limited
P6 P8 = Header 2: Header, 2-Pin; LatestRevisionDate: 17-Jul-2002; LatestRevisionNote: Re-released for DXP Platform.; Publisher: Altium Limited
P7 = Header 4: Header, 4-Pin; LatestRevisionDate: 17-Jul-2002; LatestRevisionNote: Re-released for DXP Platform.; Publisher: Altium Limited
R17-R32 = Res3: Resistor; Published: 8-Jun-2000; LatestRevisionDate: 29-May-2009; LatestRevisionNote: IPC-7351 Footprint Added.; PackageReference: J1-0603; Publisher: Altium Limited; PackageDescription: Chip Resistor

## Sheet EEG_3.SchDoc
size A3
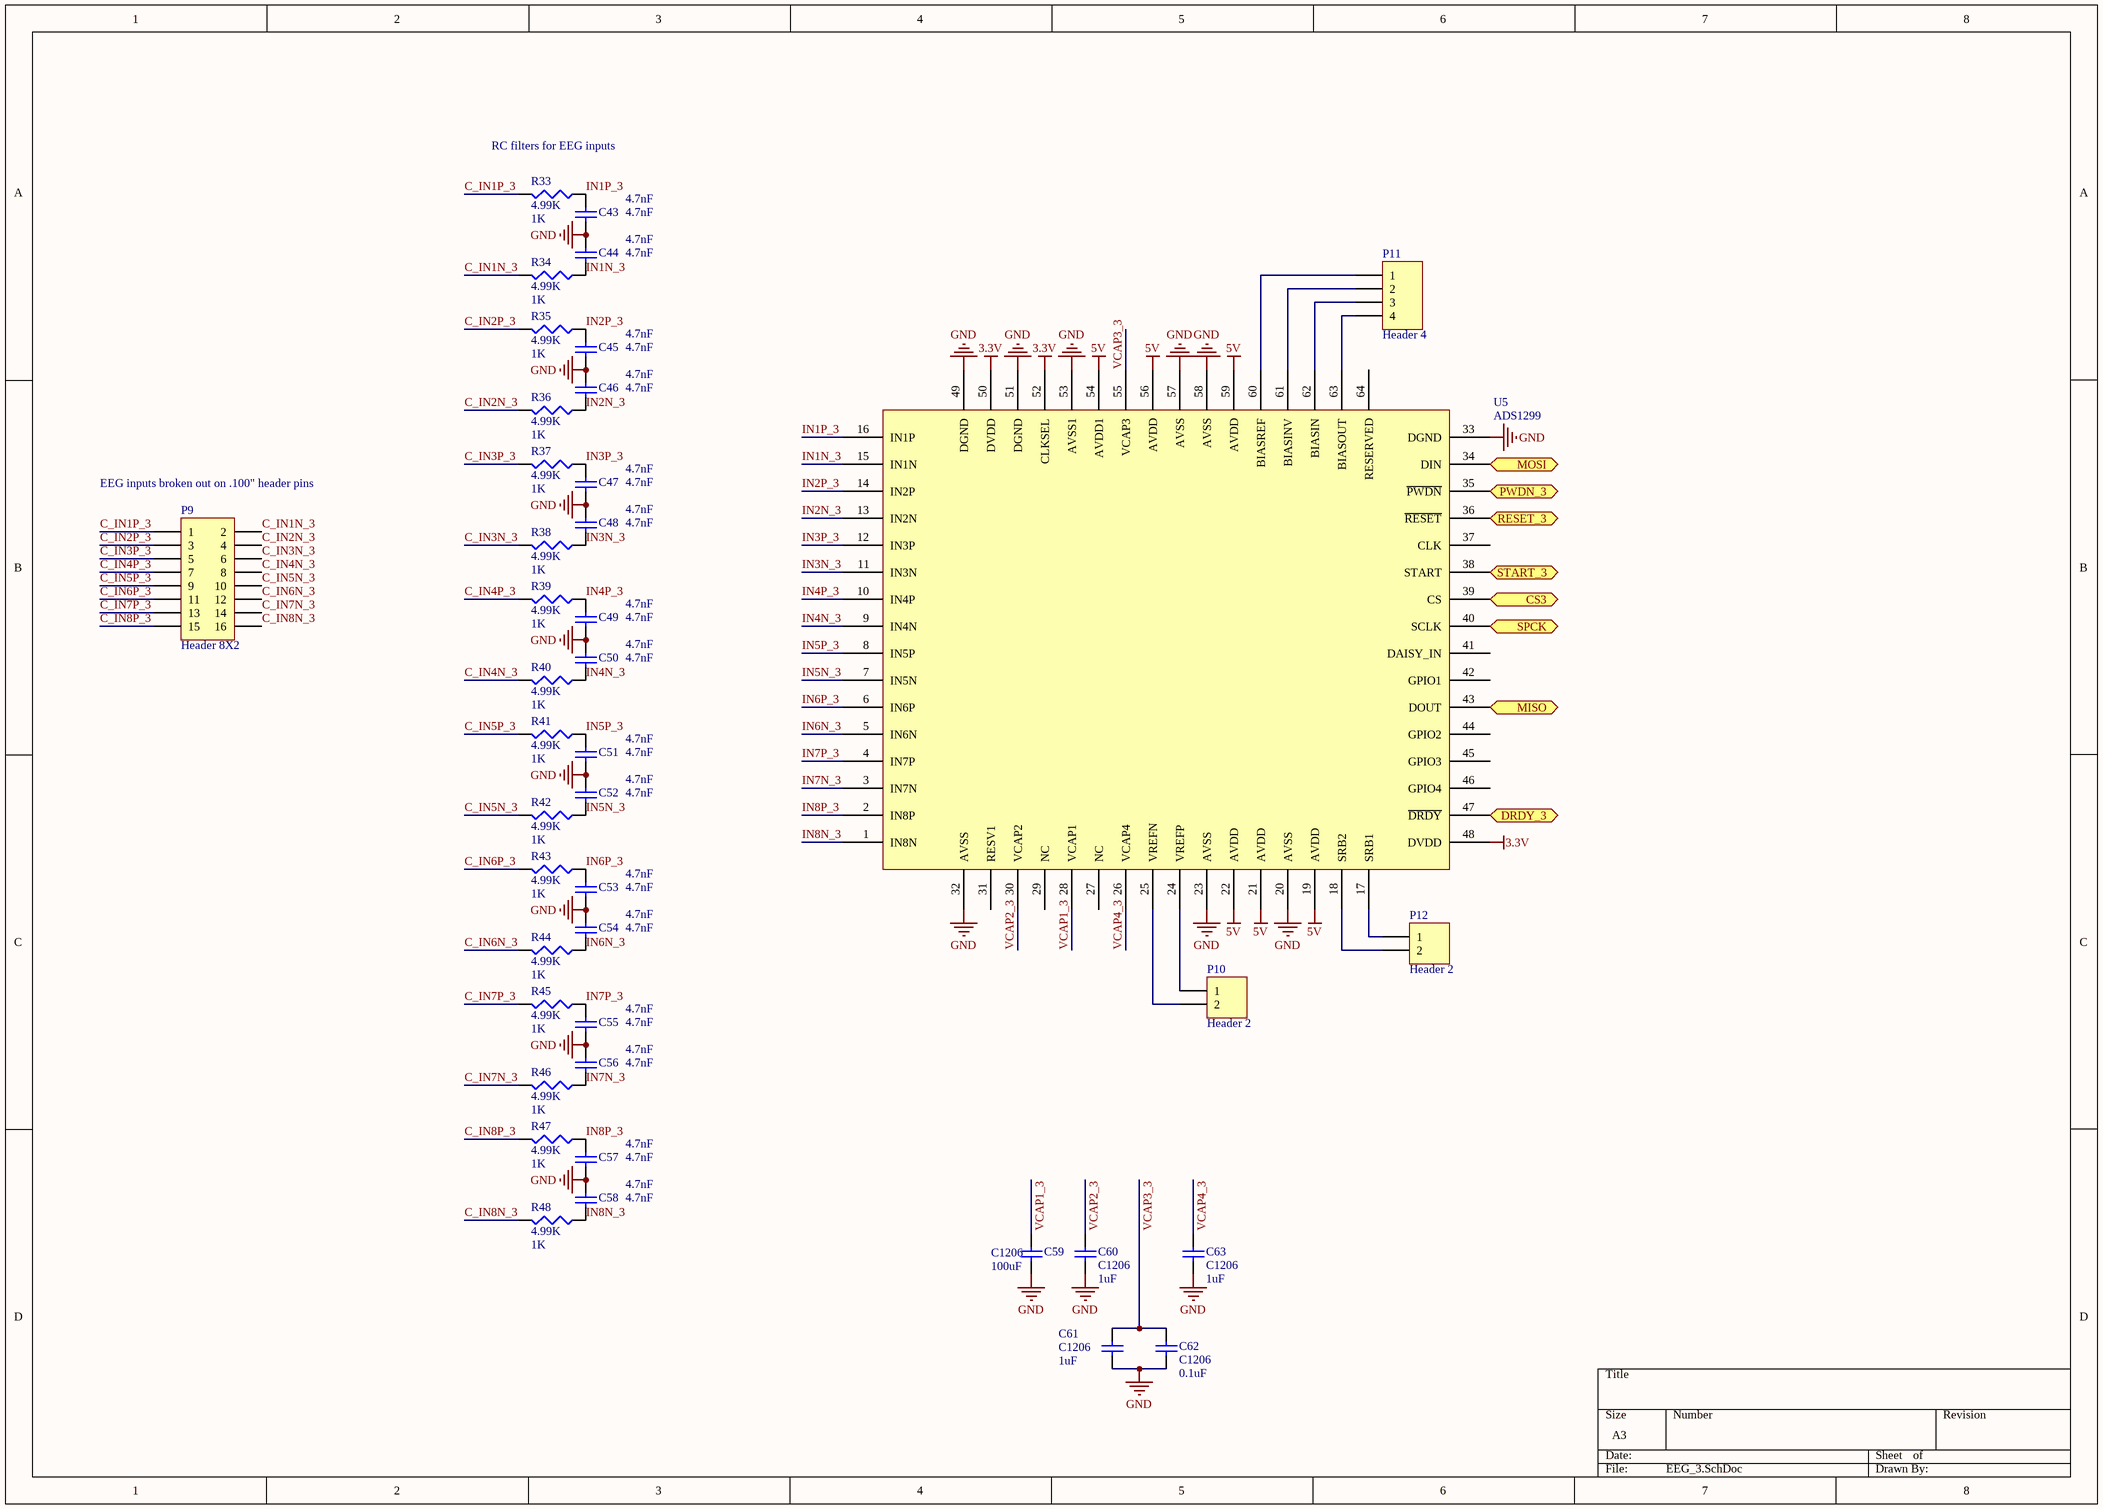
[diagram p5: EEG_3.SchDoc]

### Parts
C43  4.7nF  [1608[0603]]
C44  4.7nF  [1608[0603]]
C45  4.7nF  [1608[0603]]
C46  4.7nF  [1608[0603]]
C47  4.7nF  [1608[0603]]
C48  4.7nF  [1608[0603]]
C49  4.7nF  [1608[0603]]
C50  4.7nF  [1608[0603]]
C51  4.7nF  [1608[0603]]
C52  4.7nF  [1608[0603]]
C53  4.7nF  [1608[0603]]
C54  4.7nF  [1608[0603]]
C55  4.7nF  [1608[0603]]
C56  4.7nF  [1608[0603]]
C57  4.7nF  [1608[0603]]
C58  4.7nF  [1608[0603]]
C59  C1206  value 100uF  [1608[0603]]
C60  C1206  value 1uF  [1608[0603]]
C61  C1206  value 1uF  [1608[0603]]
C62  C1206  value 0.1uF  [1608[0603]]
C63  C1206  value 1uF  [1608[0603]]
P9  Header 8X2  [HDR2X8]
P10  Header 2  [HDR1X2]
P11  Header 4  [HDR1X4]
P12  Header 2  [HDR1X2]
R33  4.99K  value 1K  [1608[0603]]
R34  4.99K  value 1K  [1608[0603]]
R35  4.99K  value 1K  [1608[0603]]
R36  4.99K  value 1K  [1608[0603]]
R37  4.99K  value 1K  [1608[0603]]
R38  4.99K  value 1K  [1608[0603]]
R39  4.99K  value 1K  [1608[0603]]
R40  4.99K  value 1K  [1608[0603]]
R41  4.99K  value 1K  [1608[0603]]
R42  4.99K  value 1K  [1608[0603]]
R43  4.99K  value 1K  [1608[0603]]
R44  4.99K  value 1K  [1608[0603]]
R45  4.99K  value 1K  [1608[0603]]
R46  4.99K  value 1K  [1608[0603]]
R47  4.99K  value 1K  [1608[0603]]
R48  4.99K  value 1K  [1608[0603]]
U5  ADS1299  [ADS1299 Plastic QFP]

### Ports
CS3, DRDY_3, MISO, MOSI, PWDN_3, RESET_3, SPCK, START_3

### Nets
3.3V: U5.48(DVDD) U5.50(DVDD) U5.52(CLKSEL)
5V: U5.19(AVDD) U5.21(AVDD) U5.22(AVDD) U5.54(AVDD1) U5.56(AVDD) U5.59(AVDD)
GND: C43.1 C44.2 C45.1 C46.2 C47.1 C48.2 C49.1 C50.2 C51.1 C52.2 C53.1 C54.2 C55.1 C56.2 C57.1 C58.2 C59.2 C60.1 C61.2 C62.1 C63.1 U5.20(AVSS) U5.23(AVSS) U5.32(AVSS) U5.33(DGND) U5.49(DGND) U5.51(DGND) U5.53(AVSS1) U5.57(AVSS) U5.58(AVSS)
C_IN1N_3: P9.2 R34.2
C_IN1P_3: P9.1 R33.2
C_IN2N_3: P9.4 R36.2
C_IN2P_3: P9.3 R35.2
C_IN3N_3: P9.6 R38.2
C_IN3P_3: P9.5 R37.2
C_IN4N_3: P9.8 R40.2
C_IN4P_3: P9.7 R39.2
C_IN5N_3: P9.10 R42.2
C_IN5P_3: P9.9 R41.2
C_IN6N_3: P9.12 R44.2
C_IN6P_3: P9.11 R43.2
C_IN7N_3: P9.14 R46.2
C_IN7P_3: P9.13 R45.2
C_IN8N_3: P9.16 R48.2
C_IN8P_3: P9.15 R47.2
IN1N_3: C44.1 R34.1 U5.15(IN1N)
IN1P_3: C43.2 R33.1 U5.16(IN1P)
IN2N_3: C46.1 R36.1 U5.13(IN2N)
IN2P_3: C45.2 R35.1 U5.14(IN2P)
IN3N_3: C48.1 R38.1 U5.11(IN3N)
IN3P_3: C47.2 R37.1 U5.12(IN3P)
IN4N_3: C50.1 R40.1 U5.9(IN4N)
IN4P_3: C49.2 R39.1 U5.10(IN4P)
IN5N_3: C52.1 R42.1 U5.7(IN5N)
IN5P_3: C51.2 R41.1 U5.8(IN5P)
IN6N_3: C54.1 R44.1 U5.5(IN6N)
IN6P_3: C53.2 R43.1 U5.6(IN6P)
IN7N_3: C56.1 R46.1 U5.3(IN7N)
IN7P_3: C55.2 R45.1 U5.4(IN7P)
IN8N_3: C58.1 R48.1 U5.1(IN8N)
IN8P_3: C57.2 R47.1 U5.2(IN8P)
VCAP1_3: C59.1 U5.28(VCAP1)
VCAP2_3: C60.2 U5.30(VCAP2)
VCAP3_3: C61.1 C62.2 U5.55(VCAP3)
VCAP4_3: C63.2 U5.26(VCAP4)
NetP10_1: P10.1 U5.24(VREFP)
NetP10_2: P10.2 U5.25(VREFN)
NetP11_1: P11.1 U5.60(BIASREF)
NetP11_2: P11.2 U5.61(BIASINV)
NetP11_3: P11.3 U5.62(BIASIN)
NetP11_4: P11.4 U5.63(BIASOUT)
NetP12_1: P12.1 U5.17(SRB1)
NetP12_2: P12.2 U5.18(SRB2)
NetU1_87: U5.43(DOUT) ; port MISO
NetU1_88: U5.34(DIN) ; port MOSI
NetU1_91: U5.40(SCLK) ; port SPCK
NetU1_110: U5.47(~{DRDY}) ; port DRDY_3
NetU1_111: U5.39(CS) ; port CS3
NetU1_112: U5.35(~{PWDN}) ; port PWDN_3
NetU1_114: U5.36(~{RESET}) ; port RESET_3
NetU1_116: U5.38(START) ; port START_3

Not connected (* = marked no-connect by the designer): U5 27(NC) 29(NC) 31(RESV1) 37(CLK) 41(DAISY_IN) 42(GPIO1) 44(GPIO2) 45(GPIO3) 46(GPIO4) 64(RESERVED)

### Notes on the sheet
- RC filters for EEG inputs
- (near P9) EEG inputs broken out on .100" header pins

### Library data of the parts
C43-C63 = Cap Semi: Capacitor (Semiconductor SIM Model); Published: 8-Jun-2000; LatestRevisionDate: 29-May-2009; LatestRevisionNote: IPC-7351 Footprint Added.; PackageReference: C1206; Publisher: Altium Limited; PackageDescription: Chip Capacitor
  C43-C58: Value: 4.7nF
P9 = Header 8X2: Header, 8-Pin, Dual row; LatestRevisionDate: 17-Jul-2002; LatestRevisionNote: Re-released for DXP Platform.; Publisher: Altium Limited
P10 P12 = Header 2: Header, 2-Pin; LatestRevisionDate: 17-Jul-2002; LatestRevisionNote: Re-released for DXP Platform.; Publisher: Altium Limited
P11 = Header 4: Header, 4-Pin; LatestRevisionDate: 17-Jul-2002; LatestRevisionNote: Re-released for DXP Platform.; Publisher: Altium Limited
R33-R48 = Res3: Resistor; Published: 8-Jun-2000; LatestRevisionDate: 29-May-2009; LatestRevisionNote: IPC-7351 Footprint Added.; PackageReference: J1-0603; Publisher: Altium Limited; PackageDescription: Chip Resistor

## Sheet EEG_4.SchDoc
size A3
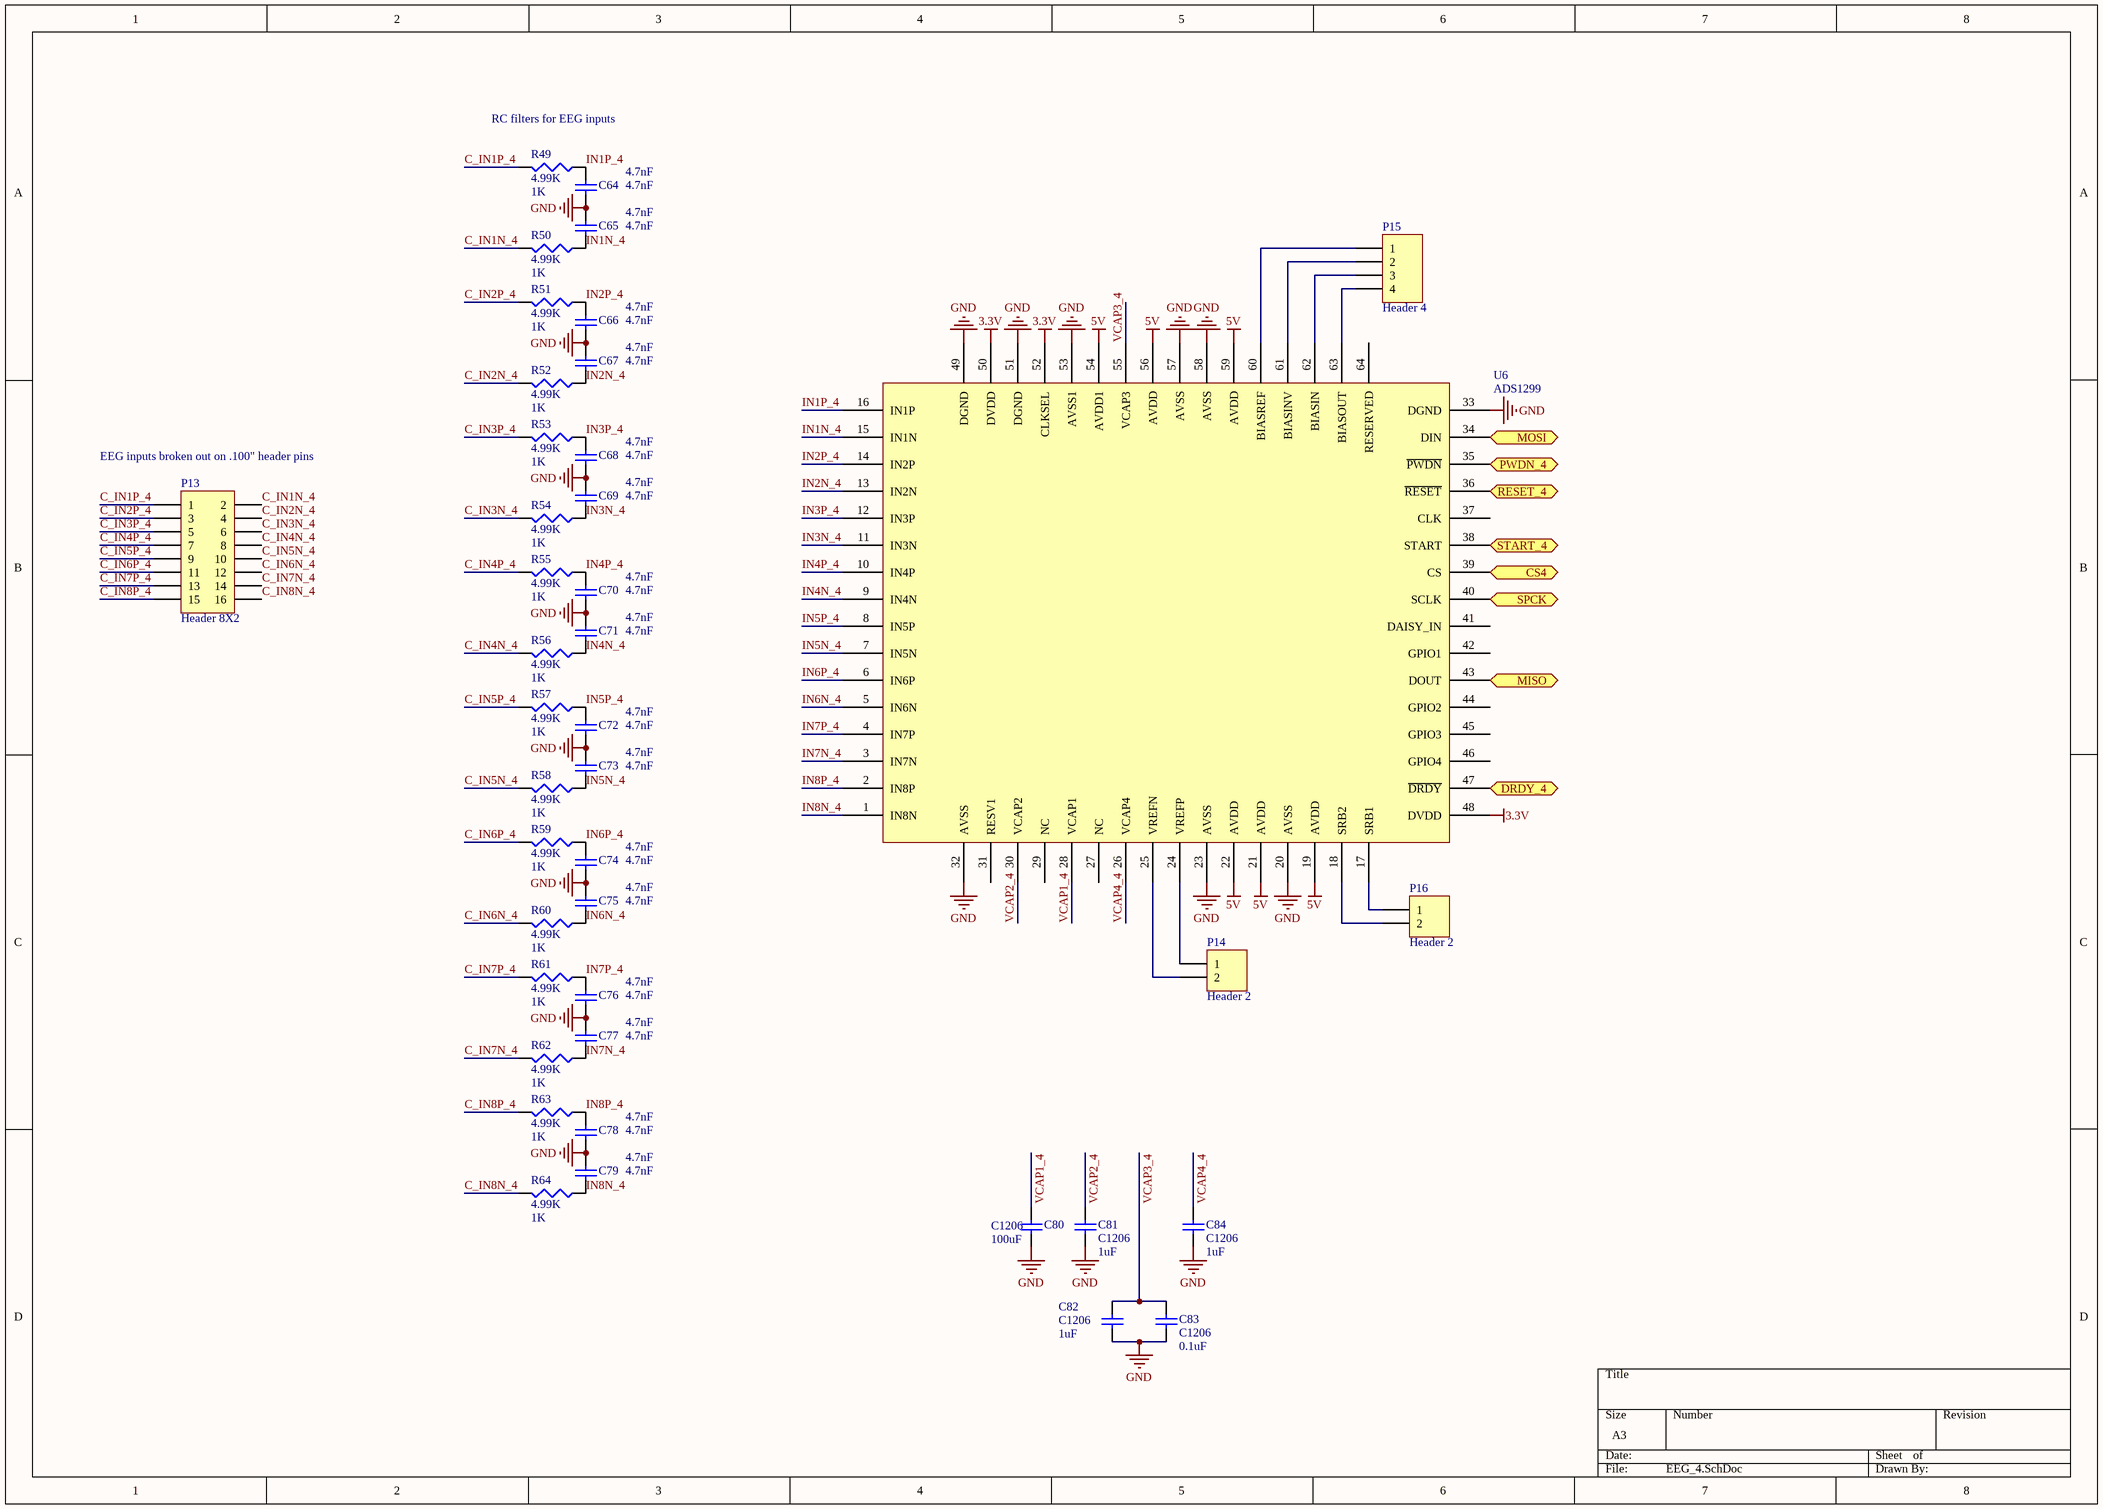
[diagram p6: EEG_4.SchDoc]

### Parts
C64  4.7nF  [1608[0603]]
C65  4.7nF  [1608[0603]]
C66  4.7nF  [1608[0603]]
C67  4.7nF  [1608[0603]]
C68  4.7nF  [1608[0603]]
C69  4.7nF  [1608[0603]]
C70  4.7nF  [1608[0603]]
C71  4.7nF  [1608[0603]]
C72  4.7nF  [1608[0603]]
C73  4.7nF  [1608[0603]]
C74  4.7nF  [1608[0603]]
C75  4.7nF  [1608[0603]]
C76  4.7nF  [1608[0603]]
C77  4.7nF  [1608[0603]]
C78  4.7nF  [1608[0603]]
C79  4.7nF  [1608[0603]]
C80  C1206  value 100uF  [1608[0603]]
C81  C1206  value 1uF  [1608[0603]]
C82  C1206  value 1uF  [1608[0603]]
C83  C1206  value 0.1uF  [1608[0603]]
C84  C1206  value 1uF  [1608[0603]]
P13  Header 8X2  [HDR2X8]
P14  Header 2  [HDR1X2]
P15  Header 4  [HDR1X4]
P16  Header 2  [HDR1X2]
R49  4.99K  value 1K  [1608[0603]]
R50  4.99K  value 1K  [1608[0603]]
R51  4.99K  value 1K  [1608[0603]]
R52  4.99K  value 1K  [1608[0603]]
R53  4.99K  value 1K  [1608[0603]]
R54  4.99K  value 1K  [1608[0603]]
R55  4.99K  value 1K  [1608[0603]]
R56  4.99K  value 1K  [1608[0603]]
R57  4.99K  value 1K  [1608[0603]]
R58  4.99K  value 1K  [1608[0603]]
R59  4.99K  value 1K  [1608[0603]]
R60  4.99K  value 1K  [1608[0603]]
R61  4.99K  value 1K  [1608[0603]]
R62  4.99K  value 1K  [1608[0603]]
R63  4.99K  value 1K  [1608[0603]]
R64  4.99K  value 1K  [1608[0603]]
U6  ADS1299  [ADS1299 Plastic QFP]

### Ports
CS4, DRDY_4, MISO, MOSI, PWDN_4, RESET_4, SPCK, START_4

### Nets
3.3V: U6.48(DVDD) U6.50(DVDD) U6.52(CLKSEL)
5V: U6.19(AVDD) U6.21(AVDD) U6.22(AVDD) U6.54(AVDD1) U6.56(AVDD) U6.59(AVDD)
GND: C64.1 C65.2 C66.1 C67.2 C68.1 C69.2 C70.1 C71.2 C72.1 C73.2 C74.1 C75.2 C76.1 C77.2 C78.1 C79.2 C80.2 C81.1 C82.2 C83.1 C84.1 U6.20(AVSS) U6.23(AVSS) U6.32(AVSS) U6.33(DGND) U6.49(DGND) U6.51(DGND) U6.53(AVSS1) U6.57(AVSS) U6.58(AVSS)
C_IN1N_4: P13.2 R50.2
C_IN1P_4: P13.1 R49.2
C_IN2N_4: P13.4 R52.2
C_IN2P_4: P13.3 R51.2
C_IN3N_4: P13.6 R54.2
C_IN3P_4: P13.5 R53.2
C_IN4N_4: P13.8 R56.2
C_IN4P_4: P13.7 R55.2
C_IN5N_4: P13.10 R58.2
C_IN5P_4: P13.9 R57.2
C_IN6N_4: P13.12 R60.2
C_IN6P_4: P13.11 R59.2
C_IN7N_4: P13.14 R62.2
C_IN7P_4: P13.13 R61.2
C_IN8N_4: P13.16 R64.2
C_IN8P_4: P13.15 R63.2
IN1N_4: C65.1 R50.1 U6.15(IN1N)
IN1P_4: C64.2 R49.1 U6.16(IN1P)
IN2N_4: C67.1 R52.1 U6.13(IN2N)
IN2P_4: C66.2 R51.1 U6.14(IN2P)
IN3N_4: C69.1 R54.1 U6.11(IN3N)
IN3P_4: C68.2 R53.1 U6.12(IN3P)
IN4N_4: C71.1 R56.1 U6.9(IN4N)
IN4P_4: C70.2 R55.1 U6.10(IN4P)
IN5N_4: C73.1 R58.1 U6.7(IN5N)
IN5P_4: C72.2 R57.1 U6.8(IN5P)
IN6N_4: C75.1 R60.1 U6.5(IN6N)
IN6P_4: C74.2 R59.1 U6.6(IN6P)
IN7N_4: C77.1 R62.1 U6.3(IN7N)
IN7P_4: C76.2 R61.1 U6.4(IN7P)
IN8N_4: C79.1 R64.1 U6.1(IN8N)
IN8P_4: C78.2 R63.1 U6.2(IN8P)
VCAP1_4: C80.1 U6.28(VCAP1)
VCAP2_4: C81.2 U6.30(VCAP2)
VCAP3_4: C82.1 C83.2 U6.55(VCAP3)
VCAP4_4: C84.2 U6.26(VCAP4)
NetP14_1: P14.1 U6.24(VREFP)
NetP14_2: P14.2 U6.25(VREFN)
NetP15_1: P15.1 U6.60(BIASREF)
NetP15_2: P15.2 U6.61(BIASINV)
NetP15_3: P15.3 U6.62(BIASIN)
NetP15_4: P15.4 U6.63(BIASOUT)
NetP16_1: P16.1 U6.17(SRB1)
NetP16_2: P16.2 U6.18(SRB2)
NetU1_8: U6.38(START) ; port START_4
NetU1_10: U6.36(~{RESET}) ; port RESET_4
NetU1_12: U6.35(~{PWDN}) ; port PWDN_4
NetU1_13: U6.47(~{DRDY}) ; port DRDY_4
NetU1_87: U6.43(DOUT) ; port MISO
NetU1_88: U6.34(DIN) ; port MOSI
NetU1_91: U6.40(SCLK) ; port SPCK
NetU1_100: U6.39(CS) ; port CS4

Not connected (* = marked no-connect by the designer): U6 27(NC) 29(NC) 31(RESV1) 37(CLK) 41(DAISY_IN) 42(GPIO1) 44(GPIO2) 45(GPIO3) 46(GPIO4) 64(RESERVED)

### Notes on the sheet
- RC filters for EEG inputs
- (near P13) EEG inputs broken out on .100" header pins

### Library data of the parts
C64-C84 = Cap Semi: Capacitor (Semiconductor SIM Model); Published: 8-Jun-2000; LatestRevisionDate: 29-May-2009; LatestRevisionNote: IPC-7351 Footprint Added.; PackageReference: C1206; Publisher: Altium Limited; PackageDescription: Chip Capacitor
  C64-C79: Value: 4.7nF
P13 = Header 8X2: Header, 8-Pin, Dual row; LatestRevisionDate: 17-Jul-2002; LatestRevisionNote: Re-released for DXP Platform.; Publisher: Altium Limited
P14 P16 = Header 2: Header, 2-Pin; LatestRevisionDate: 17-Jul-2002; LatestRevisionNote: Re-released for DXP Platform.; Publisher: Altium Limited
P15 = Header 4: Header, 4-Pin; LatestRevisionDate: 17-Jul-2002; LatestRevisionNote: Re-released for DXP Platform.; Publisher: Altium Limited
R49-R64 = Res3: Resistor; Published: 8-Jun-2000; LatestRevisionDate: 29-May-2009; LatestRevisionNote: IPC-7351 Footprint Added.; PackageReference: J1-0603; Publisher: Altium Limited; PackageDescription: Chip Resistor

## Nets that join several sheets
3.3V: Microcontroller (8 pins), JTAG_Connector (P100.1 P100.2 P101.2), USB_Controller (R200.1 U2.1 U2.10), EEG_1 (U3.48 U3.50 U3.52), EEG_2 (U4.48 U4.50 U4.52), EEG_3 (U5.48 U5.50 U5.52), EEG_4 (U6.48 U6.50 U6.52)
5V: USB_Controller (6 pins), EEG_1 (6 pins), EEG_2 (6 pins), EEG_3 (6 pins), EEG_4 (6 pins)
GND: Microcontroller (12 pins), JTAG_Connector (10 pins), USB_Controller (6 pins), EEG_1 (30 pins), EEG_2 (30 pins), EEG_3 (30 pins), EEG_4 (30 pins)
NetP100_5: Microcontroller (U1.1), JTAG_Connector (P100.5)
NetP100_7: Microcontroller (U1.4), JTAG_Connector (P100.7)
NetP100_9: Microcontroller (U1.9), JTAG_Connector (P100.9)
NetP100_13: Microcontroller (U1.7), JTAG_Connector (P100.13)
NetP100_15: Microcontroller (U1.11), JTAG_Connector (P100.15)
NetP101_1: Microcontroller (U1.138), JTAG_Connector (P101.1)
NetP102_2: Microcontroller (U1.38), USB_Controller (P102.2)
NetP102_3: Microcontroller (U1.37), USB_Controller (P102.3)
NetU1_8: Microcontroller (U1.8), EEG_4 (U6.38)
NetU1_10: Microcontroller (U1.10), EEG_4 (U6.36)
NetU1_12: Microcontroller (U1.12), EEG_4 (U6.35)
NetU1_13: Microcontroller (U1.13), EEG_4 (U6.47)
NetU1_14: Microcontroller (U1.14), EEG_2 (U4.38)
NetU1_29: Microcontroller (U1.29), EEG_2 (U4.47)
NetU1_30: Microcontroller (U1.30), EEG_1 (U3.47)
NetU1_59: Microcontroller (U1.59), EEG_1 (U3.35)
NetU1_61: Microcontroller (U1.61), EEG_1 (U3.36)
NetU1_62: Microcontroller (U1.62), EEG_1 (U3.38)
NetU1_87: Microcontroller (U1.87), EEG_1 (U3.43), EEG_2 (U4.43), EEG_3 (U5.43), EEG_4 (U6.43)
NetU1_88: Microcontroller (U1.88), EEG_1 (U3.34), EEG_2 (U4.34), EEG_3 (U5.34), EEG_4 (U6.34)
NetU1_91: Microcontroller (U1.91), EEG_1 (U3.40), EEG_2 (U4.40), EEG_3 (U5.40), EEG_4 (U6.40)
NetU1_93: Microcontroller (U1.93), EEG_1 (U3.39)
NetU1_96: Microcontroller (U1.96), EEG_2 (U4.36)
NetU1_97: Microcontroller (U1.97), EEG_2 (U4.35)
NetU1_100: Microcontroller (U1.100), EEG_4 (U6.39)
NetU1_109: Microcontroller (U1.109), EEG_2 (U4.39)
NetU1_110: Microcontroller (U1.110), EEG_3 (U5.47)
NetU1_111: Microcontroller (U1.111), EEG_3 (U5.39)
NetU1_112: Microcontroller (U1.112), EEG_3 (U5.35)
NetU1_114: Microcontroller (U1.114), EEG_3 (U5.36)
NetU1_116: Microcontroller (U1.116), EEG_3 (U5.38)